# Altium project OpticalSensor.PrjPcb
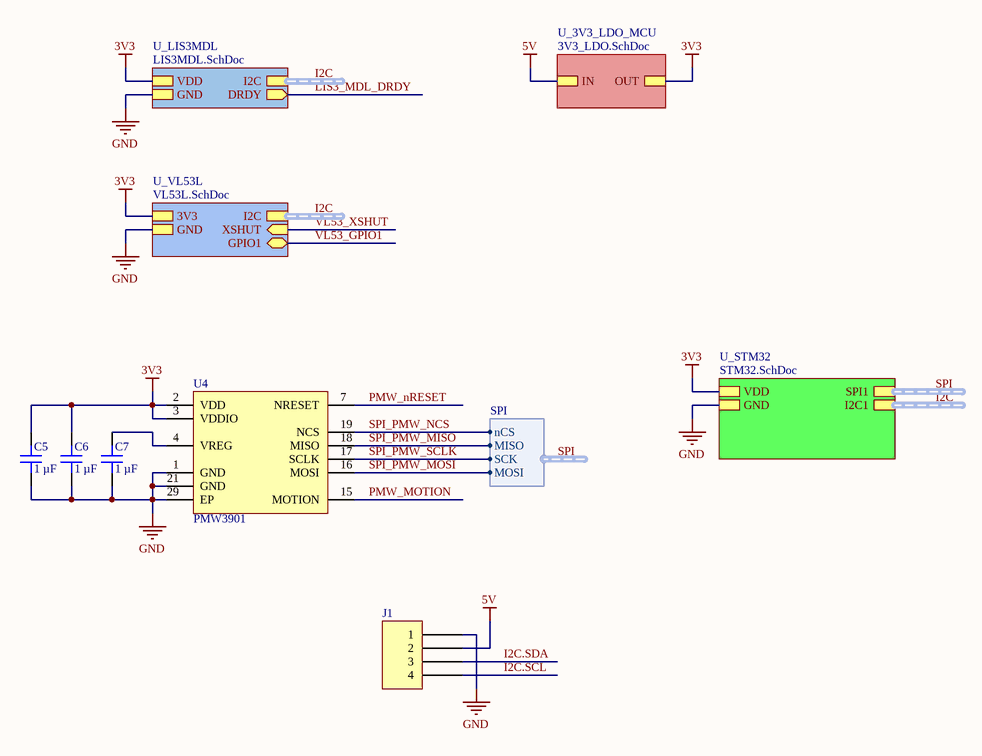
[diagram p0: OpticalSensor.SchDoc]
5 sheets, 25 parts. Net scope: hierarchical (ports join the sheet entries above them; power ports are global).
Board file: OpticalSensor.PcbDoc
Sheets:
  OpticalSensor.SchDoc
    U_3V3_LDO_MCU = 3V3_LDO.SchDoc
    U_LIS3MDL = LIS3MDL.SchDoc
    U_STM32 = STM32.SchDoc
    U_VL53L = VL53L.SchDoc

## Sheet OpticalSensor.SchDoc
size A; SheetNumber: 1; SheetTotal: 5

### Parts
C5  1 µF  [CAP 0402_1005]
C6  1 µF  [CAP 0402_1005]
C7  1 µF  [CAP 0402_1005]
J1  SM04B-SRSS-TB(LF)(SN)  [JST SM04B-SRSS-TB]  (value not drawn)
U4  PMW3901  [PMW3901]

### Sub-sheets
U_3V3_LDO_MCU = 3V3_LDO.SchDoc: OUT, IN
U_LIS3MDL = LIS3MDL.SchDoc: VDD, GND, I2C (harness I2C), DRDY (out)
U_STM32 = STM32.SchDoc: VDD, GND, SPI1 (harness SPI), I2C1 (harness I2C)
U_VL53L = VL53L.SchDoc: 3V3, GND, XSHUT (in), GPIO1 (bidir), I2C (harness I2C)

### Harnesses
SPI: MOSI, MISO, SCK, nCS

### Nets
3V3: C5.2 C6.2 U4.2(VDD) U4.3(VDDIO) ; sheet U_3V3_LDO_MCU/OUT, sheet U_LIS3MDL/VDD, sheet U_STM32/VDD, sheet U_VL53L/3V3
5V: J1.2 ; sheet U_3V3_LDO_MCU/IN
GND: C5.1 C6.1 C7.1 J1.1 U4.1(GND) U4.21(GND) U4.29(EP) ; sheet U_LIS3MDL/GND, sheet U_STM32/GND, sheet U_VL53L/GND
I2C.SCL: J1.4
I2C.SDA: J1.3
PMW_MOTION: U4.15(MOTION)
PMW_nRESET: U4.7(NRESET)
SPI_PMW_MISO: U4.18(MISO) ; sheet U_STM32/SPI1.MISO  [project net SPI.MISO]
SPI_PMW_MOSI: U4.16(MOSI) ; sheet U_STM32/SPI1.MOSI  [project net SPI.MOSI]
SPI_PMW_NCS: U4.19(NCS) ; sheet U_STM32/SPI1.nCS  [project net SPI.nCS]
SPI_PMW_SCLK: U4.17(SCLK) ; sheet U_STM32/SPI1.SCK  [project net SPI.SCK]
NetC7_2: C7.2 U4.4(VREG)

### Buses and harness runs
harness I2C = sheet U_LIS3MDL/I2C
harness I2C = sheet U_STM32/I2C1
harness I2C = sheet U_VL53L/I2C
harness SPI = sheet U_STM32/SPI1

### Library data of the parts
C5-C7 = C0402C104K4RACAUTO: CAP CER 0.1UF 16V X7R 0402; manufacturer: KEMET; Capacitance: 0.1 µF; Tolerance: ±10%; Part Number: C0402C104K4RACAUTO; Value: 1 µF; Applications: Automotive, Bypass, Decoupling; componentlink1description: Datasheet; componentlink1url: https://api.kemet.com/component-edge/download/specsheet/C0402C104K4RACAUTO.pdf; componentlink2description: DigiKey Link; componentlink2url: https://www.digikey.com/en/products/detail/kemet/C0402C104K4RACAUTO/3314827; Device Package: 0402 (1005 Metric); lastupdated: 8/14/2022 9:05:51 PM; Lifecycle Status: Active; Minimum Order: 1; Mounting Type: Surface Mount, MLCC; Operating Temperature: -55°C ~ 125°C; Package / Case: 0402 (1005 Metric); packaging: TapeAndReel; partid: 3024; Part Status: Active; price: 0.01; Ratings: AEC-Q200; series: SMD Auto X7R; Size / Dimension: 0.039" L x 0.020" W (1.00mm x 0.50mm); Supplier 1: DigiKey; Supplier Part Number 1: 399-6828-1-ND; Temperature Coefficient: X7R; Thickness (Max): 0.022" (0.55mm); Voltage - Rated: 16V
J1 = SM04B-SRSS-TB(LF)(SN): CONN HEADER SMD R/A 4POS 1MM; Manufacturer: JST Sales America Inc.; Current Rating (Amps): 0.7A; Material Flammability Rating: UL94 V-0; Number of Positions: 4; Number of Positions Loaded: All; Pitch - Mating: 0.039" (1.00mm); Shrouding: Shrouded - 4 Wall; Style: Board to Cable/Wire; Voltage Rating: 50V; Part Number: SM04B-SRSS-TB(LF)(SN); ComponentLink1Description: Datasheet; ComponentLink1URL: http://www.jst-mfg.com/product/pdf/eng/eSH.pdf; ComponentLink2Description: DigiKey Link; ComponentLink2URL: http://digikey.com/product-detail/en/jst-sales-america-inc/SM04B-SRSS-TB-LF-SN/455-1804-1-ND/926875; Connector Type: Header; Contact Finish - Mating: Tin; Contact Finish - Post: Tin; Contact Material: Copper Alloy; Contact Shape: Square; Contact Type: Male Pin; Fastening Type: Push-Pull; Features: Solder Retention; Insulation Color: Natural; Insulation Height: 0.114" (2.90mm); Insulation Material: Polyamide (PA), Nylon; LastUpdated: 1/12/2020 11:41:52 PM; Lifecycle Status: Active; Minimum Order: 1; Mounting Type: Surface Mount, Right Angle; Number of Rows: 1; Operating Temperature: -25°C ~ 85°C; Packaging: TapeAndReel; PartId: 62; Part Status: Active; Price: 0.26; Series: SR; Supplier 1: DigiKey; Supplier Part Number 1: 455-1804-1-ND; Termination: Solder
U4 = PMW3901: PMW3901. Optical Flow Sensor

## Sheet 3V3_LDO.SchDoc
size A; SheetNumber: 2; SheetTotal: 5
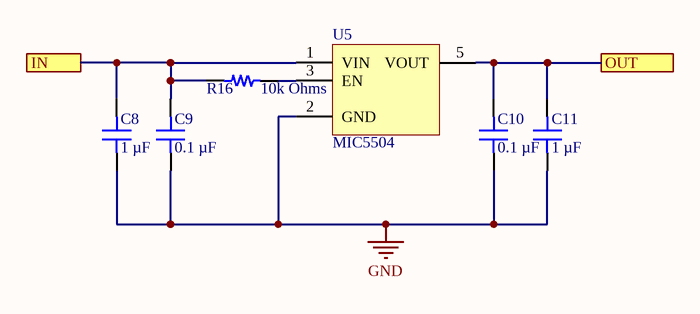
[diagram p1: 3V3_LDO.SchDoc]

### Parts
C8  1 µF  [CAP 0402_1005]
C9  0.1 µF  [CAP 0402_1005]
C10  0.1 µF  [CAP 0402_1005]
C11  1 µF  [CAP 0402_1005]
R16  10k Ohms  [RES 0402_1005]
U5  MIC5504  [TI SOT-23-5 DBV]

### Ports
IN, OUT

### Nets
3V3: C10.2 C11.2 U5.5(VOUT) ; port OUT
5V: C8.2 C9.2 R16.2 U5.1(VIN) ; port IN
GND: C8.1 C9.1 C10.1 C11.1 U5.2(GND)
NetR16_1: R16.1 U5.3(EN)

### Library data of the parts
C8 C11 = C0402C104K4RACAUTO: as C5 on sheet OpticalSensor; Part Number: C0402C104K4RACAUTO; Value: 1 µF; Applications: Automotive, Bypass, Decoupling; componentlink1description: Datasheet; componentlink1url: https://api.kemet.com/component-edge/download/specsheet/C0402C104K4RACAUTO.pdf; componentlink2description: DigiKey Link; componentlink2url: https://www.digikey.com/en/products/detail/kemet/C0402C104K4RACAUTO/3314827; Device Package: 0402 (1005 Metric); lastupdated: 8/14/2022 9:05:51 PM; Lifecycle Status: Active; Minimum Order: 1; Mounting Type: Surface Mount, MLCC; Operating Temperature: -55°C ~ 125°C; Package / Case: 0402 (1005 Metric); packaging: TapeAndReel; partid: 3024; Part Status: Active; price: 0.01; Ratings: AEC-Q200; series: SMD Auto X7R; Size / Dimension: 0.039" L x 0.020" W (1.00mm x 0.50mm); Supplier 1: DigiKey; Supplier Part Number 1: 399-6828-1-ND; Temperature Coefficient: X7R; Thickness (Max): 0.022" (0.55mm); Voltage - Rated: 16V
C9 C10 = C0402C104K4RACAUTO: CAP CER 0.1UF 16V X7R 0402; manufacturer: KEMET; Tolerance: ±10%; Part Number: C0402C104K4RACAUTO; Value: 0.1 µF; Applications: Automotive, Bypass, Decoupling; Capacitance: 0.1 µF; componentlink1description: Datasheet; componentlink1url: https://api.kemet.com/component-edge/download/specsheet/C0402C104K4RACAUTO.pdf; componentlink2description: DigiKey Link; componentlink2url: https://www.digikey.com/en/products/detail/kemet/C0402C104K4RACAUTO/3314827; Device Package: 0402 (1005 Metric); lastupdated: 8/14/2022 9:05:51 PM; Lifecycle Status: Active; Minimum Order: 1; Mounting Type: Surface Mount, MLCC; Operating Temperature: -55°C ~ 125°C; Package / Case: 0402 (1005 Metric); packaging: TapeAndReel; partid: 3024; Part Status: Active; price: 0.01; Ratings: AEC-Q200; series: SMD Auto X7R; Size / Dimension: 0.039" L x 0.020" W (1.00mm x 0.50mm); Supplier 1: DigiKey; Supplier Part Number 1: 399-6828-1-ND; Temperature Coefficient: X7R; Thickness (Max): 0.022" (0.55mm); Voltage - Rated: 16V
R16 = CRCW0402330RJNEDC: RES 330 OHM 5% 1/16W 0402; Manufacturer: Vishay Dale; Power (Watts): 0.063W, 1/16W; Resistance: 330 Ohms; Temperature Coefficient: ±200ppm/°C; Part Number: CRCW0402330RJNEDC; Value: 10k Ohms; ComponentLink1Description: Datasheet; ComponentLink1URL: http://www.vishay.com/docs/28773/crcwce3.pdf; ComponentLink2Description: DigiKey Link; ComponentLink2URL: https://www.digikey.com/en/products/detail/vishay-dale/CRCW0402330RJNEDC/7928545; Composition: Thick Film; Device Package: 0402 (1005 Metric); Height - Seated (Max): 0.014" (0.35mm); LastUpdated: 8/14/2022 9:23:31 PM; Lifecycle Status: Active; Minimum Order: 1; Number of Terminations: 2; Operating Temperature: -55°C ~ 155°C; Package / Case: 0402 (1005 Metric); Packaging: CutTape; PartId: 15989; Part Status: Active; Price: 0.01; Series: CRCW-C; Size / Dimension: 0.039" L x 0.020" W (1.00mm x 0.50mm); Supplier 1: DigiKey; Supplier Part Number 1: 541-4123-1-ND; Supplier Device Package: 0402; Tolerance: ±5%
U5 = MIC5504-3.3YM5: 3.3V LDO

## Sheet LIS3MDL.SchDoc
size A; SheetNumber: 3; SheetTotal: 5
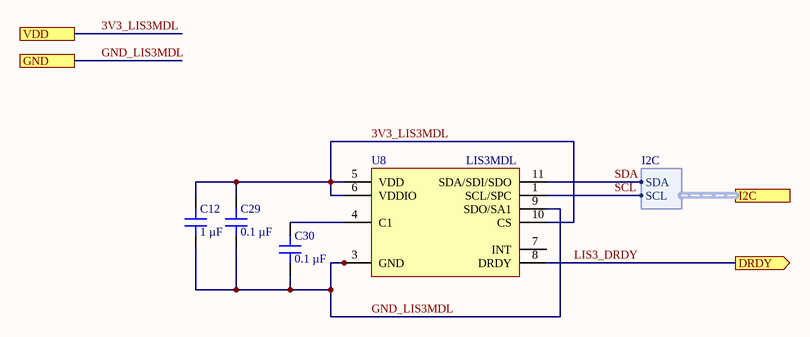
[diagram p2: LIS3MDL.SchDoc]

### Parts
C12  1 µF  [CAP 0402_1005]
C29  0.1 µF  [CAP 0402_1005]
C30  0.1 µF  [CAP 0402_1005]
U8  LIS3MDL  [LGA12_ST]

### Ports
DRDY (out), GND, I2C (harness I2C), VDD

### Harnesses
I2C: SCL, SDA

### Nets
3V3_LIS3MDL: C12.1 C29.1 U8.5(VDD) U8.6(VDDIO) U8.10(CS) ; port VDD  [project net 3V3]
GND_LIS3MDL: C12.2 C29.2 C30.2 U8.2(Reserved) U8.3(GND) U8.9(SDO/SA1) U8.12(Reserved) ; port GND  [project net GND]
LIS3_DRDY: U8.8(DRDY) ; port DRDY  [project net LIS3_MDL_DRDY]
SCL: U8.1(SCL/SPC) ; port I2C.SCL  [project net I2C.SCL]
SDA: U8.11(SDA/SDI/SDO) ; port I2C.SDA  [project net I2C.SDA]
NetC30_1: C30.1 U8.4(C1)

Not connected (* = marked no-connect by the designer): U8 7(INT)

### Library data of the parts
C12 = C0402C104K4RACAUTO: as C5 on sheet OpticalSensor; Part Number: C0402C104K4RACAUTO; Value: 1 µF; Applications: Automotive, Bypass, Decoupling; componentlink1description: Datasheet; componentlink1url: https://api.kemet.com/component-edge/download/specsheet/C0402C104K4RACAUTO.pdf; componentlink2description: DigiKey Link; componentlink2url: https://www.digikey.com/en/products/detail/kemet/C0402C104K4RACAUTO/3314827; Device Package: 0402 (1005 Metric); lastupdated: 8/14/2022 9:05:51 PM; Lifecycle Status: Active; Minimum Order: 1; Mounting Type: Surface Mount, MLCC; Operating Temperature: -55°C ~ 125°C; Package / Case: 0402 (1005 Metric); packaging: TapeAndReel; partid: 3024; Part Status: Active; price: 0.01; Ratings: AEC-Q200; series: SMD Auto X7R; Size / Dimension: 0.039" L x 0.020" W (1.00mm x 0.50mm); Supplier 1: DigiKey; Supplier Part Number 1: 399-6828-1-ND; Temperature Coefficient: X7R; Thickness (Max): 0.022" (0.55mm); Voltage - Rated: 16V
C29 C30 = C0402C104K4RACAUTO: as C9 on sheet 3V3_LDO; Part Number: C0402C104K4RACAUTO; Value: 0.1 µF; Applications: Automotive, Bypass, Decoupling; Capacitance: 0.1 µF; componentlink1description: Datasheet; componentlink1url: https://api.kemet.com/component-edge/download/specsheet/C0402C104K4RACAUTO.pdf; componentlink2description: DigiKey Link; componentlink2url: https://www.digikey.com/en/products/detail/kemet/C0402C104K4RACAUTO/3314827; Device Package: 0402 (1005 Metric); lastupdated: 8/14/2022 9:05:51 PM; Lifecycle Status: Active; Minimum Order: 1; Mounting Type: Surface Mount, MLCC; Operating Temperature: -55°C ~ 125°C; Package / Case: 0402 (1005 Metric); packaging: TapeAndReel; partid: 3024; Part Status: Active; price: 0.01; Ratings: AEC-Q200; series: SMD Auto X7R; Size / Dimension: 0.039" L x 0.020" W (1.00mm x 0.50mm); Supplier 1: DigiKey; Supplier Part Number 1: 399-6828-1-ND; Temperature Coefficient: X7R; Thickness (Max): 0.022" (0.55mm); Voltage - Rated: 16V
U8 = LIS3MDL: Magnetometer

## Sheet STM32.SchDoc
size A; SheetNumber: 4; SheetTotal: 5
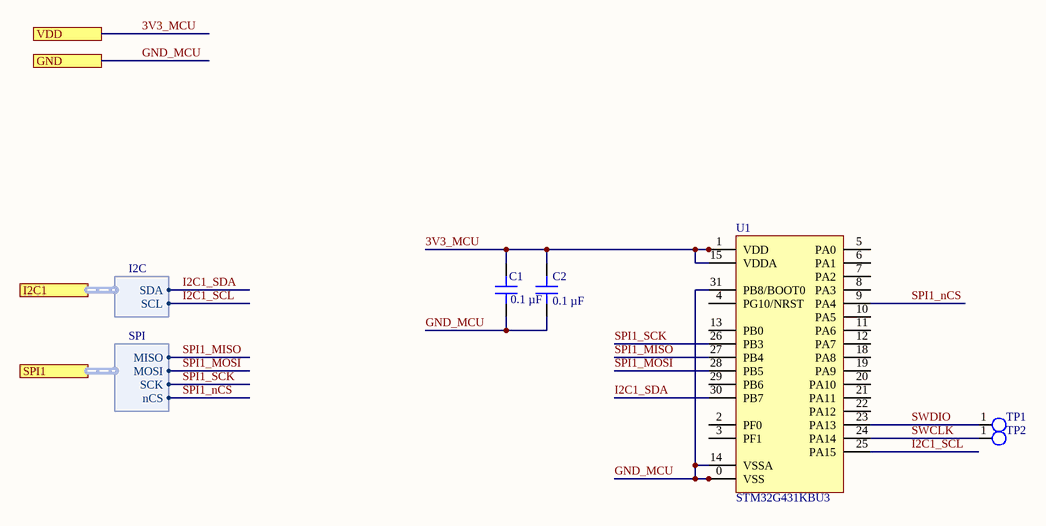
[diagram p3: STM32.SchDoc]

### Parts
C1  0.1 µF  [CAP 0402_1005]
C2  0.1 µF  [CAP 0402_1005]
TP1  0.8mm  [TP  0.8mm]  (value not drawn)
TP2  0.8mm  [TP  0.8mm]  (value not drawn)
U1  STM32G431KBU3  [QFN50P400X400X60-32N]

### Ports
GND, I2C1 (harness I2C), SPI1 (harness SPI), VDD

### Harnesses
I2C: SCL, SDA
SPI: MOSI, MISO, SCK, nCS

### Nets
3V3_MCU: C1.2 C2.2 U1.1(VDD) U1.15(VDDA) U1.17(VDD) ; port VDD  [project net 3V3]
GND_MCU: C1.1 C2.1 U1.0(VSS) U1.14(VSSA) U1.16(VSS) U1.31(PB8/BOOT0) U1.32(VSS) ; port GND  [project net GND]
I2C1_SCL: U1.25(PA15) ; port I2C1.SCL  [project net I2C.SCL]
I2C1_SDA: U1.30(PB7) ; port I2C1.SDA  [project net I2C.SDA]
SPI1_MISO: U1.27(PB4) ; port SPI1.MISO  [project net SPI.MISO]
SPI1_MOSI: U1.28(PB5) ; port SPI1.MOSI  [project net SPI.MOSI]
SPI1_nCS: U1.9(PA4) ; port SPI1.nCS  [project net SPI.nCS]
SPI1_SCK: U1.26(PB3) ; port SPI1.SCK  [project net SPI.SCK]
SWCLK: TP2.1(TP) U1.24(PA14)
SWDIO: TP1.1(TP) U1.23(PA13)

Not connected (* = marked no-connect by the designer): U1 2(PF0) 3(PF1) 4(PG10/NRST) 5(PA0) 6(PA1) 7(PA2) 8(PA3) 10(PA5) 11(PA6) 12(PA7) 13(PB0) 18(PA8) 19(PA9) 20(PA10) 21(PA11) 22(PA12) 29(PB6)

### Library data of the parts
C1 C2 = C0402C104K4RACAUTO: as C9 on sheet 3V3_LDO; Part Number: C0402C104K4RACAUTO; Value: 0.1 µF; Applications: Automotive, Bypass, Decoupling; Capacitance: 0.1 µF; componentlink1description: Datasheet; componentlink1url: https://api.kemet.com/component-edge/download/specsheet/C0402C104K4RACAUTO.pdf; componentlink2description: DigiKey Link; componentlink2url: https://www.digikey.com/en/products/detail/kemet/C0402C104K4RACAUTO/3314827; Device Package: 0402 (1005 Metric); lastupdated: 8/14/2022 9:05:51 PM; Lifecycle Status: Active; Minimum Order: 1; Mounting Type: Surface Mount, MLCC; Operating Temperature: -55°C ~ 125°C; Package / Case: 0402 (1005 Metric); packaging: TapeAndReel; partid: 3024; Part Status: Active; price: 0.01; Ratings: AEC-Q200; series: SMD Auto X7R; Size / Dimension: 0.039" L x 0.020" W (1.00mm x 0.50mm); Supplier 1: DigiKey; Supplier Part Number 1: 399-6828-1-ND; Temperature Coefficient: X7R; Thickness (Max): 0.022" (0.55mm); Voltage - Rated: 16V
TP1 TP2 = TP 0.8mm: Test point
U1 = STM32G431KBU3: MCU UFQFPN-32

## Sheet VL53L.SchDoc
size A; SheetNumber: 5; SheetTotal: 5
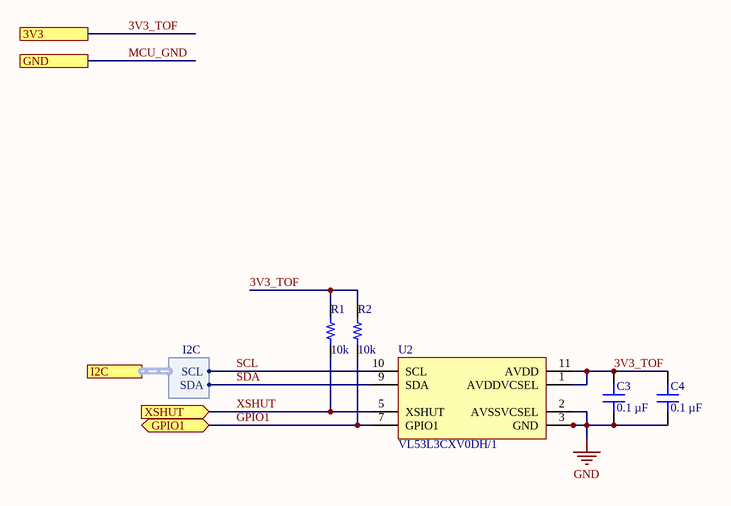
[diagram p4: VL53L.SchDoc]

### Parts
C3  0.1 µF  [CAP 0402_1005]
C4  0.1 µF  [CAP 0402_1005]
R1  10k  [RES 0402_1005]
R2  10k  [RES 0402_1005]
U2  VL53L3CXV0DH/1  [XDCR_VL53L3CXV0DH/1]

### Ports
3V3, GND, GPIO1 (bidir), I2C (harness I2C), XSHUT (in)

### Harnesses
I2C: SCL, SDA

### Nets
3V3_TOF: C3.2 C4.2 R1.1 R2.1 U2.1(AVDDVCSEL) U2.11(AVDD) ; port 3V3  [project net 3V3]
GND: C3.1 C4.1 U2.2(AVSSVCSEL) U2.3(GND) U2.4(GND) U2.6(GND) U2.12(GND) ; port GND  [also labelled MCU_GND]
GPIO1: R2.2 U2.7(GPIO1) ; port GPIO1  [project net VL53_GPIO1]
SCL: U2.10(SCL) ; port I2C.SCL  [project net I2C.SCL]
SDA: U2.9(SDA) ; port I2C.SDA  [project net I2C.SDA]
XSHUT: R1.2 U2.5(XSHUT) ; port XSHUT  [project net VL53_XSHUT]

### Library data of the parts
C3 C4 = C0402C104K4RACAUTO: as C9 on sheet 3V3_LDO; Part Number: C0402C104K4RACAUTO; Value: 0.1 µF; Applications: Automotive, Bypass, Decoupling; Capacitance: 0.1 µF; componentlink1description: Datasheet; componentlink1url: https://api.kemet.com/component-edge/download/specsheet/C0402C104K4RACAUTO.pdf; componentlink2description: DigiKey Link; componentlink2url: https://www.digikey.com/en/products/detail/kemet/C0402C104K4RACAUTO/3314827; Device Package: 0402 (1005 Metric); lastupdated: 8/14/2022 9:05:51 PM; Lifecycle Status: Active; Minimum Order: 1; Mounting Type: Surface Mount, MLCC; Operating Temperature: -55°C ~ 125°C; Package / Case: 0402 (1005 Metric); packaging: TapeAndReel; partid: 3024; Part Status: Active; price: 0.01; Ratings: AEC-Q200; series: SMD Auto X7R; Size / Dimension: 0.039" L x 0.020" W (1.00mm x 0.50mm); Supplier 1: DigiKey; Supplier Part Number 1: 399-6828-1-ND; Temperature Coefficient: X7R; Thickness (Max): 0.022" (0.55mm); Voltage - Rated: 16V
R1 R2 = CRCW0402330RJNEDC: as R16 on sheet 3V3_LDO; Part Number: CRCW0402330RJNEDC; Value: 10k; ComponentLink1Description: Datasheet; ComponentLink1URL: http://www.vishay.com/docs/28773/crcwce3.pdf; ComponentLink2Description: DigiKey Link; ComponentLink2URL: https://www.digikey.com/en/products/detail/vishay-dale/CRCW0402330RJNEDC/7928545; Composition: Thick Film; Device Package: 0402 (1005 Metric); Height - Seated (Max): 0.014" (0.35mm); LastUpdated: 8/14/2022 9:23:31 PM; Lifecycle Status: Active; Minimum Order: 1; Number of Terminations: 2; Operating Temperature: -55°C ~ 155°C; Package / Case: 0402 (1005 Metric); Packaging: CutTape; PartId: 15989; Part Status: Active; Price: 0.01; Series: CRCW-C; Size / Dimension: 0.039" L x 0.020" W (1.00mm x 0.50mm); Supplier 1: DigiKey; Supplier Part Number 1: 541-4123-1-ND; Supplier Device Package: 0402; Tolerance: ±5%
U2 = VL53L3CXV0DH/1: Optical Sensor 118.110 (3m) I2C Output; MF: STMicroelectronics; Value: *; Availability: Unavailable; Package: None; SnapEDA_Link: https://www.snapeda.com/parts/VL53L3CXV0DH/1/STMicroelectronics/view-part/4775788/?ref=snap; MP: VL53L3CXV0DH/1; Price: None

## Nets that join several sheets
3V3: OpticalSensor (C5.2 C6.2 U4.2 U4.3), 3V3_LDO (C10.2 C11.2 U5.5), LIS3MDL (5 pins), STM32 (5 pins), VL53L (6 pins)
5V: OpticalSensor (J1.2), 3V3_LDO (C8.2 C9.2 R16.2 U5.1)
GND: OpticalSensor (7 pins), 3V3_LDO (5 pins), LIS3MDL (7 pins), STM32 (7 pins), VL53L (7 pins)
I2C.SCL: LIS3MDL (U8.1), STM32 (U1.25), VL53L (U2.10)
I2C.SDA: LIS3MDL (U8.11), STM32 (U1.30), VL53L (U2.9)
SPI.MISO: OpticalSensor (U4.18), STM32 (U1.27)
SPI.MOSI: OpticalSensor (U4.16), STM32 (U1.28)
SPI.nCS: OpticalSensor (U4.19), STM32 (U1.9)
SPI.SCK: OpticalSensor (U4.17), STM32 (U1.26)

## Assembly variants
Main: all parts fitted